# EAGLE design arwe (EAGLE 6.3)
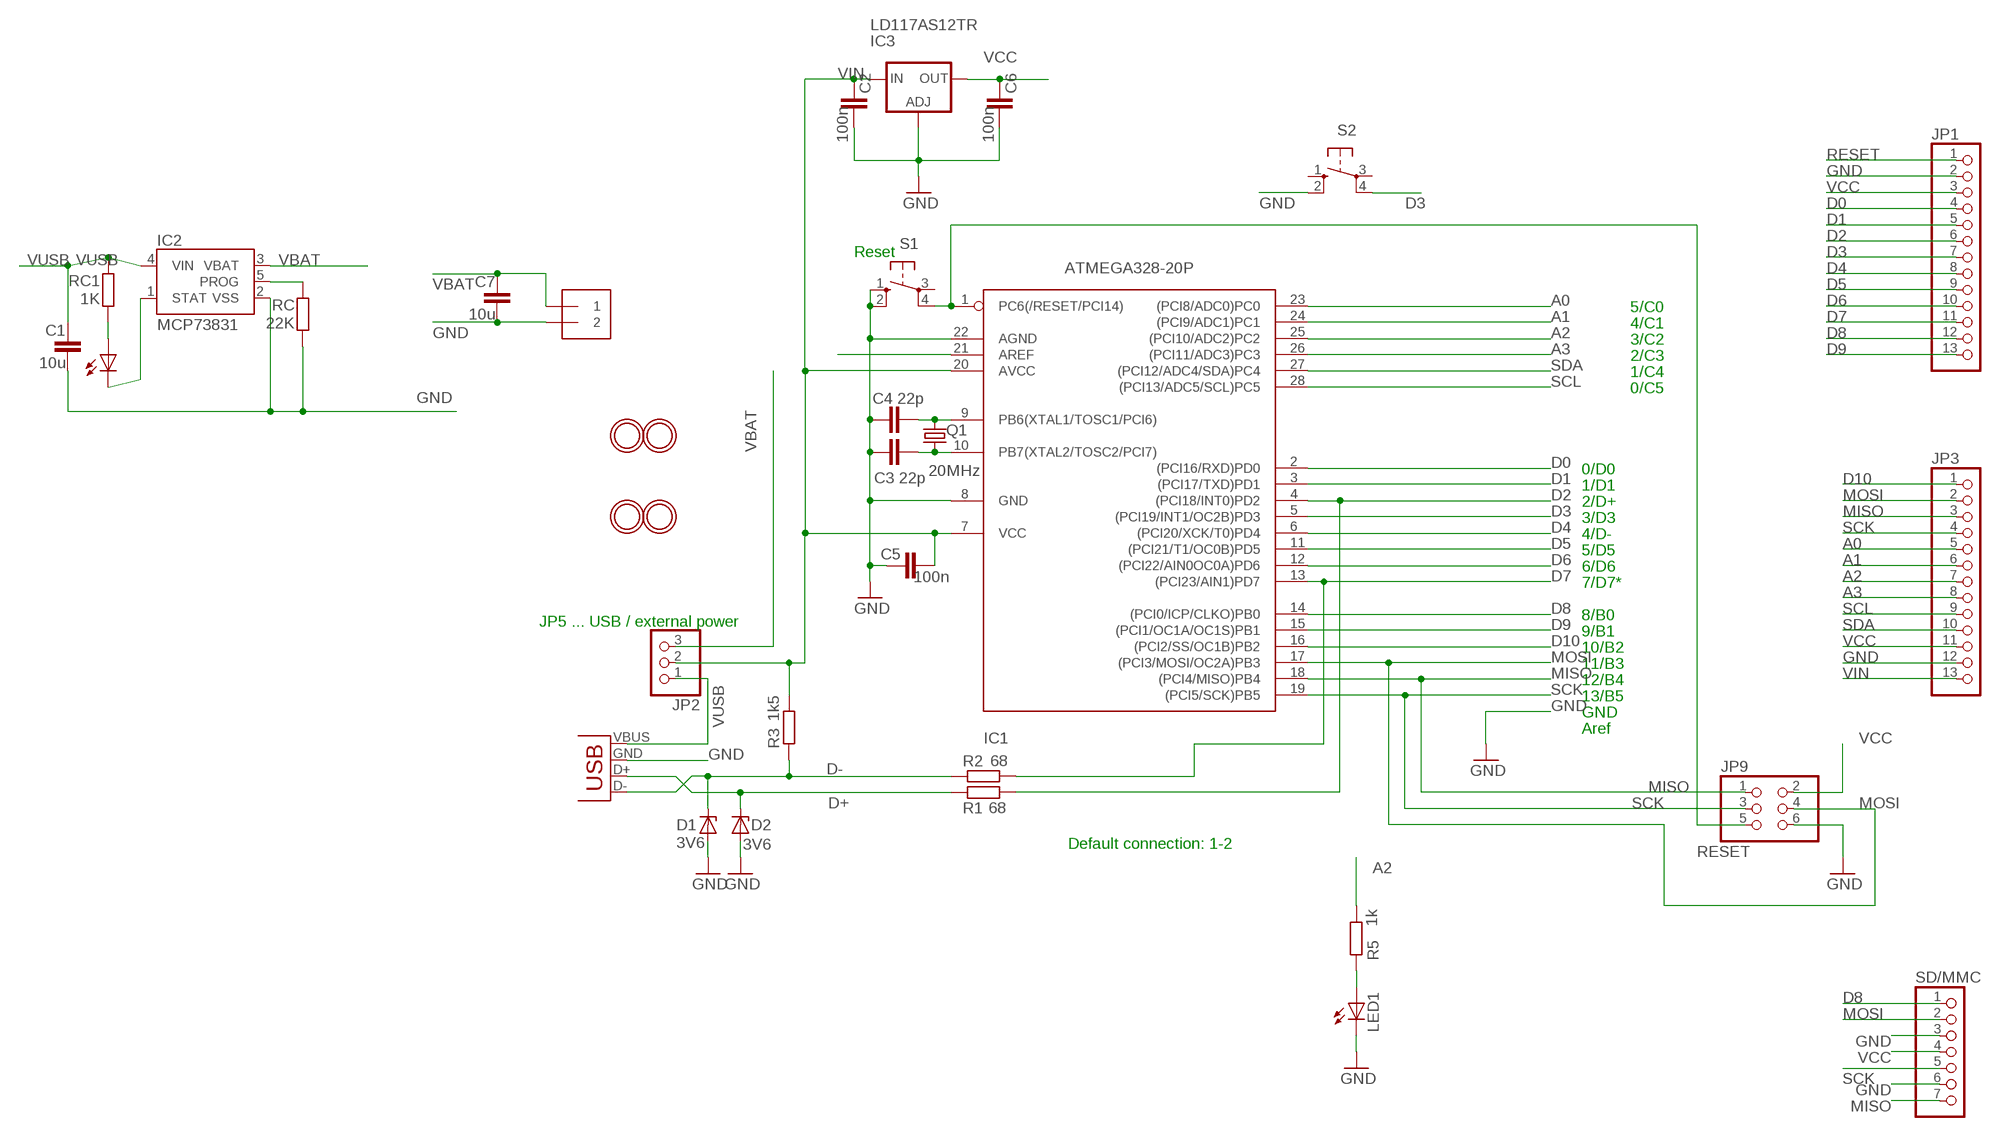
[diagram p0: schematic, sheet 1]

## Parts
C1  10u  C-EUC0603  [C0603]
C2  100n  C-EU025-024X044  [C025-024X044]
C3  22p  C-EU025-024X044  [C025-024X044]
C4  22p  C-EU025-024X044  [C025-024X044]
C5  100n  C-EU025-024X044  [C025-024X044]
C6  100n  C-EU025-024X044  [C025-024X044]
C7  10u  C-EUC0603  [C0603]
CHG  0805  LEDCHIPLED_0603  [CHIPLED_0603]
D1  3V6  ZENER-DIODEZD-5  [ZDIO-5]
D2  3V6  ZENER-DIODEZD-5  [ZDIO-5]
IC1  ATMEGA328-20P  ATMEGA168-20P  [DIL28-3]
IC2  MCP73831  [SOT23-5]
IC3  LD117AS12TR  [SOT223]
J1  1X2-3.5MM  [1X2-3.5MM]
JP1  PINHD-1X13  [1X13]
JP2  PINHD-1X3  [1X03]
JP3  PINHD-1X13  [1X13]
JP9  PINHD-2X3  [2X03]
LED1  LED3MM  [LED3MM]
Q1  20MHz  CRYSTALHC49S  [HC49/S]
R1  68  R-EU_0204/5  [0204/5]
R2  68  R-EU_0204/5  [0204/5]
R3  1k5  R-EU_0204/5  [0204/5]
R5  1k  R-EU_0204/5  [0204/5]
RC  22K  R-EU_R0603  [R0603]
RC1  1K  R-EU_R0603  [R0603]
S1  10-XX  [B3F-10XX]
S2  10-XX  [B3F-10XX]
SD/MMC  PINHD-1X7  [1X07]
U$2  MOUNTINGHOLE3.0THIN  [MOUNTINGHOLE_3.0_PLATEDTHIN]
U$3  MOUNTINGHOLE3.0THIN  [MOUNTINGHOLE_3.0_PLATEDTHIN]
U$4  MOUNTINGHOLE3.0THIN  [MOUNTINGHOLE_3.0_PLATEDTHIN]
U$5  MOUNTINGHOLE3.0THIN  [MOUNTINGHOLE_3.0_PLATEDTHIN]
X1  USB-A-H  [USB-A-H]

## Nets
A0: IC1.23((PCI8/ADC0)PC0) JP3.5
A1: IC1.24((PCI9/ADC1)PC1) JP3.6
A2: IC1.25((PCI10/ADC2)PC2) JP3.7 R5.1
A3: IC1.26((PCI11/ADC3)PC3) JP3.8
AREF_RAW: IC1.21(AREF)
D0: IC1.2((PCI16/RXD)PD0) JP1.4
D1: IC1.3((PCI17/TXD)PD1) JP1.5
D2: IC1.4((PCI18/INT0)PD2) JP1.6 R1.2
D3: IC1.5((PCI19/INT1/OC2B)PD3) JP1.7 S2.4(P1)
D4: IC1.6((PCI20/XCK/T0)PD4) JP1.8
D5: IC1.11((PCI21/T1/OC0B)PD5) JP1.9
D6: IC1.12((PCI22/AIN0OC0A)PD6) JP1.10
D7: IC1.13((PCI23/AIN1)PD7) JP1.11 R2.2
D8: IC1.14((PCI0/ICP/CLKO)PB0) JP1.12 SD/MMC.1
D9: IC1.15((PCI1/OC1A/OC1S)PB1) JP1.13
D10: IC1.16((PCI2/SS/OC1B)PB2) JP3.1
D+: D2.C R1.1 X1.D+(D-)
D-: D1.C R2.1 R3.1 X1.D-(D+)
GND: C1.2 C2.2 C3.1 C4.1 C5.1 C6.2 C7.2 D1.A D2.A IC1.8(GND) IC1.22(AGND) IC2.2(VSS) IC3.1(ADJ) J1.2 JP1.2 JP3.12 JP9.6 LED1.K(C) RC.1 S1.1(S) S1.2(S1) S2.2(S1) SD/MMC.3 SD/MMC.6 X1.GND(VBUS)
MISO: IC1.18((PCI4/MISO)PB4) JP3.3 JP9.1 SD/MMC.7
MOSI: IC1.17((PCI3/MOSI/OC2A)PB3) JP3.2 JP9.4 SD/MMC.2
N$1: LED1.A R5.2
N$4: CHG.A RC1.1
N$5: CHG.C IC2.1(STAT)
N$6: IC2.5(PROG) RC.2
N$9: C3.2 IC1.10(PB7(XTAL2/TOSC2/PCI7)) Q1.1
N$10: C4.2 IC1.9(PB6(XTAL1/TOSC1/PCI6)) Q1.2
RESET: IC1.1(PC6(/RESET/PCI14)) JP1.1 JP9.5 S1.4(P1)
SCK: IC1.19((PCI5/SCK)PB5) JP3.4 JP9.3 SD/MMC.5
SCL: IC1.28((PCI13/ADC5/SCL)PC5) JP3.9
SDA: IC1.27((PCI12/ADC4/SDA)PC4) JP3.10
VBAT: C7.1 IC2.3(VBAT) J1.1 JP2.3
VCC: C6.1 IC3.4(OUT) JP1.3 JP3.11 JP9.2 SD/MMC.4
VIN: C2.1 C5.2 IC1.7(VCC) IC1.20(AVCC) IC3.3(IN) JP2.2 JP3.13 R3.2
VUSB: C1.1 IC2.4(VIN) JP2.1 RC1.2 X1.VBUS(GND)
Unconnected: S1.3(P) S2.1(S) S2.3(P)

## Notes on the sheet
- Reset
- 5/C0
- 4/C1
- 3/C2
- 2/C3
- 1/C4
- 0/C5
- 0/D0
- 1/D1
- 2/D+
- 3/D3
- 4/D-
- 5/D5
- 6/D6
- 7/D7*
- 8/B0
- JP5 ... USB / external power
- 9/B1
- 10/B2
- 11/B3
- 12/B4
- 13/B5
- GND
- Aref
- Default connection: 1-2

## Library data of the parts
C1 C7 = resistor:C-EU: CAPACITOR, European symbol
C2-C6 = rcl:C-EU: CAPACITOR, European symbol
CHG LED1 = led:LED: LED OSRAM: - CHIPLED LG R971, LG N971, LY N971, LG Q971, LY Q971, LO R971, LY R971 LH N974, LH R974 LS Q976, LO Q976, LY Q976 LO Q996 - Hyper CHIPLED LW Q18S LB Q993, LB Q99A, LB R99A - SideLED LS A670, LO A670, LY A670, LG A670, LP A670 LB A673, LV A673, LT A673, LW A673 LH A674 LY A675 LS A676, LA A676, LO A676, LY A676, LW A676 LS A679, LY A679, LG A679 - Hyper Micro SIDELED® LS Y876, LA Y876, LO Y876, LY Y876 LT Y87S - SmartLED LW L88C, LW L88S LB L89C, LB L89S, LG L890 LS L89K, LO L89K, LY L89K LS L896, LA L896, LO L896, LY L896 - TOPLED LS T670, LO T670, LY T670, LG T670, LP T670 LSG T670, LSP T670, LSY T670, LOP T670, LYG T670 LG T671, LOG T671, LSG T671 LB T673, LV T673, LT T673, LW T673 LH T674 LS T676, LA T676, LO T676, LY T676, LB T676, LH T676, LSB T676, LW T676 LB T67C, LV T67C, LT T67C, LS T67K, LO T67K, LY T67K, LW E67C LS E67B, LA E67B, LO E67B, LY E67B, LB E67C, LV E67C, LT E67C LW T67C LS T679, LY T679, LG T679 LS T770, LO T770, LY T770, LG T770, LP T770 LB T773, LV T773, LT T773, LW T773 LH T774 LS E675, LA E675, LY E675, LS T675 LS T776, LA T776, LO T776, LY T776, LB T776 LHGB T686 LT T68C, LB T68C - Hyper Mini TOPLED® LB M676 - Mini TOPLED Santana® LG M470 LS M47K, LO M47K, LY M47K Source: http://www.osram.convergy.de LUXEON: - LUMILED® LXK2-PW12-R00, LXK2-PW12-S00, LXK2-PW14-U00, LXK2-PW14-V00 LXK2-PM12-R00, LXK2-PM12-S00, LXK2-PM14-U00 LXK2-PE12-Q00, LXK2-PE12-R00, LXK2-PE12-S00, LXK2-PE14-T00, LXK2-PE14-U00 LXK2-PB12-K00, LXK2-PB12-L00, LXK2-PB12-M00, LXK2-PB14-N00, LXK2-PB14-P00, LXK2-PB14-Q00 LXK2-PR12-L00, LXK2-PR12-M00, LXK2-PR14-Q00, LXK2-PR14-R00 LXK2-PD12-Q00, LXK2-PD12-R00, LXK2-PD12-S00 LXK2-PH12-R00, LXK2-PH12-S00 LXK2-PL12-P00, LXK2-PL12-Q00, LXK2-PL12-R00 Source: www.luxeon.com KINGBRIGHT: KA-3528ASYC Source: www.kingbright.com
D1 D2 = diode:ZENER-DIODE: Z-Diode
IC1 = avr:ATMEGA168*P: MICROCONTROLLER 16 kBytes FLASH 1 kBytes SRAM 512 Bytes EEPROM USART 8-channel 10 bit ADC
IC2 = SparkFunNew:MCP73831: Microchip's MCP73831 Miniature single cell, fully integrated Li-Ion, Li-polymer charge management controller http://ww1.microchip.com/downloads/en/DeviceDoc/21984a.pdf
IC3 = v-reg:LD117A?*: Low drop fixed and adjustable positive voltage regulators 1 A Source: http://www.st.com/stonline/products/literature/ds/7194/ld1117axx.pdf
J1 = adafruit:1X2: 3.5mm Terminal block http://www.ladyada.net/library/pcb/eaglelibrary.html
JP1 JP3 = pinhead:PINHD-1X13: PIN HEADER
JP2 = pinhead:PINHD-1X3: PIN HEADER
JP9 = pinhead:PINHD-2X3: PIN HEADER
Q1 = crystal:CRYSTAL: CRYSTAL; OC_FARNELL: 1667008; OC_NEWARK: unknown
R1-R3 R5 RC RC1 = rcl:R-EU_: RESISTOR, European symbol
S1 S2 = switch-omron:10-XX: OMRON SWITCH; MPN: B3F-1000; OC_FARNELL: 176432; OC_NEWARK: 36M3542
SD/MMC = pinhead:PINHD-1X7: PIN HEADER
U$2-U$5 = microbuilder:MOUNTINGHOLE: Mounting Hole
X1 = SparkFun:USB: USB Connectors USB-B-PTH is fully proven SKU : PRT-00139 USB-miniB is fully proven SKU : PRT-00587 USB-A-PCB is untested. USB-A-H is throughly reviewed, but untested. Spark Fun Electronics SKU : PRT-00437 USB-B-SMT is throughly reviewed, but untested. Needs silkscreen touching up. USB-A-S has not been used/tested USB-MB-H has not been used/tested

## Net classes
0 default: width 0.279 mm, drill 0.381 mm, clearance 0.305 mm
1 GND: width 0.229 mm, drill 0.381 mm, clearance 0.229 mm

## Board
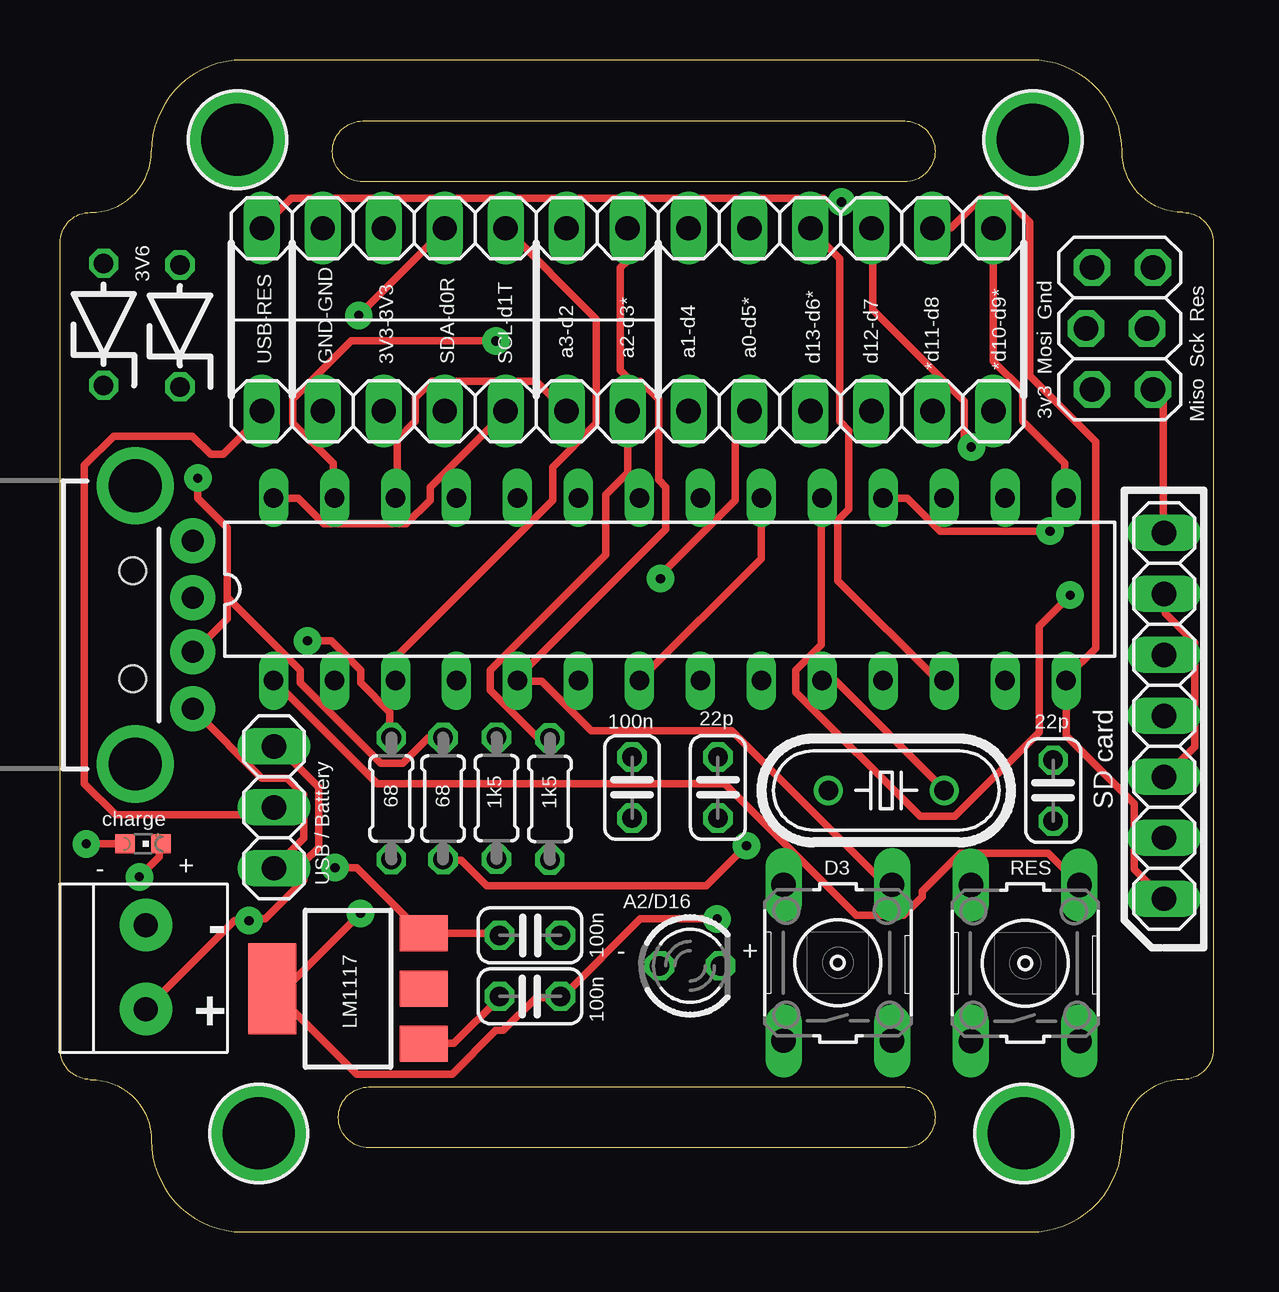
[diagram p1: board, top side]
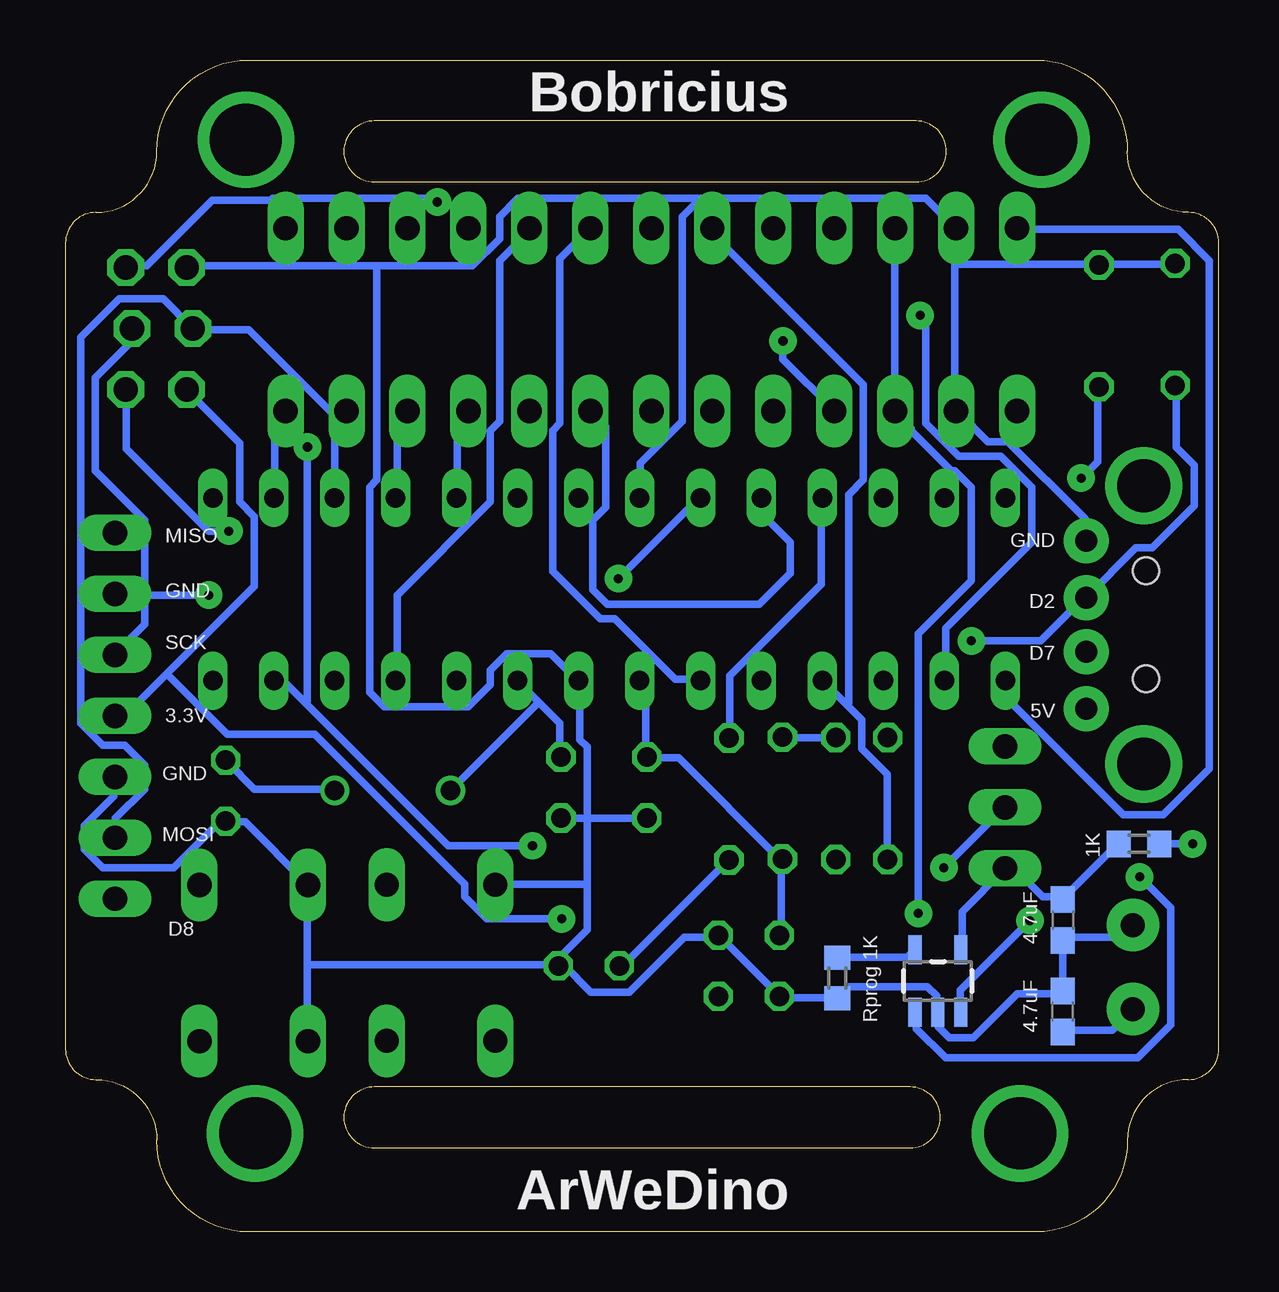
[diagram p2: board, bottom side, seen from below]

Size 48.06 x 48.83 mm. Coordinates in mm from the lower left corner, seen from the top.
Outline: 46.79,42.48 arc-90 48.06,41.21 48.06,7.62 arc-90 46.79,6.35 arc90 44.25,3.81 arc-90 40.44,0 7.62,0 arc-90 3.81,3.81 arc90 1.27,6.35 arc-90 0,7.62 0,41.21 arc-90 1.27,42.48 arc90 3.81,45.02 arc-90 7.62,48.83 40.44,48.83 arc-90 44.25,45.02 arc90 46.79,42.48
Outline: 35.19,46.29 arc-90 36.46,45.02 arc-90 35.19,43.75 12.62,43.75 arc-90 11.35,45.02 arc-90 12.62,46.29 35.19,46.29
Outline: 35.19,6.04 arc-90 36.46,4.77 arc-90 35.19,3.5 12.87,3.5 arc-90 11.6,4.77 arc-90 12.87,6.04 35.19,6.04
Copper layers (1*16): Top 0.035mm / dielectric 1.5mm / Bottom 0.035mm
Design rules "mine *": minimum track width 12mil, minimum drill 12mil, track to track 8mil, track to pad 8mil, pad to pad 8mil, via to via 8mil, smd to smd 8mil, copper to edge 8mil, drill to drill 20mil, minimum pad ring 8mil, minimum via ring 15mil, stop-mask expansion 4mil, vias tented up to drill 20mil, thermal gap 10mil
tRestrict: area 2.9,44.4 to 48.9,51.1; area -1.5,-3.3 to 54.8,5.8
bRestrict: area -2.6,-3.5 to 53.6,5.8; area 1.4,44.2 to 49.9,52

### Footprints (pad centres in the part's own frame; a part is rotated, then mirrored left to right if it is on the bottom)
C0603 = smd 1.1 x 1: 1 -0.85,0; 2 0.85,0
C025-024X044 = drill 0.813 octagon: 1 -1.27,0; 2 1.27,0
CHIPLED_0603 = smd 0.8 x 0.8: A 0,-0.75; C 0,0.75
ZDIO-5 = drill 0.813 octagon: A 2.54,0; C -2.54,0
DIL28-3 = drill 0.813 long: 1 -16.51,-3.81; 2 -13.97,-3.81; 3 -11.43,-3.81; 4 -8.89,-3.81; 5 -6.35,-3.81; 6 -3.81,-3.81; 7 -1.27,-3.81; 8 1.27,-3.81; 9 3.81,-3.81; 10 6.35,-3.81; 11 8.89,-3.81; 12 11.43,-3.81; 13 13.97,-3.81; 14 16.51,-3.81; 15 16.51,3.81; 16 13.97,3.81; 17 11.43,3.81; 18 8.89,3.81; 19 6.35,3.81; 20 3.81,3.81; 21 1.27,3.81; 22 -1.27,3.81; 23 -3.81,3.81; 24 -6.35,3.81; 25 -8.89,3.81; 26 -11.43,3.81; 27 -13.97,3.81; 28 -16.51,3.81
SOT23-5 = smd 0.55 x 1.2: 1 -0.95,-1.3; 2 0,-1.3; 3 0.95,-1.3; 4 0.95,1.3; 5 -0.95,1.3
SOT223 = smd 1.5 x 2: 1 -2.3,-3.15; 2 0,-3.15; 3 2.3,-3.15 | smd 3.8 x 2: 4 0,3.15
1X2-3.5MM = drill 1 pad 2.184: 1 1.8,0; 2 -1.7,0
1X13 = drill 1.016 long: 1 -15.24,0; 2 -12.7,0; 3 -10.16,0; 4 -7.62,0; 5 -5.08,0; 6 -2.54,0; 7 0,0; 8 2.54,0; 9 5.08,0; 10 7.62,0; 11 10.16,0; 12 12.7,0; 13 15.24,0
1X03 = drill 1.016 long: 1 -2.54,0; 2 0,0; 3 2.54,0
2X03 = drill 1.016 octagon: 1 -2.54,-1.397; 2 -2.54,1.143; 3 0,-1.143; 4 0,1.397; 5 2.54,-1.397; 6 2.54,1.143
LED3MM = drill 0.813 octagon: A -1.27,0; K 1.27,0
HC49/S = drill 0.813: 1 -2.413,0; 2 2.413,0
0204/5 = drill 0.813 octagon: 1 -2.54,0; 2 2.54,0
R0603 = smd 1 x 1.1: 1 -0.85,0; 2 0.85,0
B3F-10XX = drill 1.016 long: 1 -3.251,2.261; 2 3.251,2.261; 3 -3.251,-2.261; 4 3.251,-2.261
1X07 = drill 1.016 long: 1 -7.62,0; 2 -5.08,0; 3 -2.54,0; 4 0,0; 5 2.54,0; 6 5.08,0; 7 7.62,0
MOUNTINGHOLE_3.0_PLATEDTHIN = drill 3 pad 3.6: P$1 0,0
USB-A-H = drill 0.914 pad 1.88: D+ 2.4,1.127; D- 2.4,-1.127; GND 2.4,3.5; VBUS 2.4,-3.5 | drill 2.2: GND2 0,-5.8; GND3 0,5.8 | hole 1.1: -0.1,2.25; -0.1,-2.25

### Placement (x,y rotation side)
C1  6.5,12.99 270 bottom
C2  19.59,12.36 0 top
C3  41.38,18.39 90 top
C4  27.41,18.51 90 top
C5  23.84,18.51 90 top
C6  19.59,9.82 180 top
C7  6.5,9.18 90 bottom
CHG  3.46,16.17 270 top
D1  5,37.75 90 top
D2  1.82,37.82 90 top
IC1  25.41,26.78 0 top
IC2  11.71,10.45 0 bottom
IC3  12,10.14 90 top
J1  3.58,11.09 270 top
JP1  23.65,41.82 0 top
JP2  8.92,17.69 90 top
JP3  23.65,34.2 180 top
JP9  44.15,37.64 90 top
LED1  26.25,11.09 0 top
Q1  34.43,18.39 180 top
R1  13.8,18.06 270 top
R2  15.96,18.06 270 top
R3  18.19,18.07 270 top
R5  20.41,18.04 270 top
RC  15.9,10.58 90 bottom
RC1  3.33,16.17 180 bottom
S1  40.22,11.2 90 top
S2  32.41,11.22 90 top
SD/MMC  46,21.5 90 top
U$2  40.16,4.1 0 top
U$3  8.28,4.1 0 top
U$4  7.39,45.5 0 top
U$5  40.54,45.5 0 top
X1  3.13,25.29 0 top

### Tracks (layer width: path | path; a pad name or v marks a point on that pad's centre or on a via)
A0  (via drill 0.38)
  Top 0.305: v25.02,27.22 25.02,27.37 28.14,30.49 28.14,33.62 JP3.5
  Bottom 0.305: v25.02,27.22 21.67,30.57 IC1.23
A1
  Bottom 0.305: IC1.24 19,30.57 19,29.88 17.86,28.74 17.86,27.45 19.15,26.15 25.48,26.15 26.09,26.76 26.09,29.66 25.55,30.19 25.55,33.54 26.16,34.15 JP3.6
A2
  Top 0.305: JP3.7 23.65,31.64 22.73,30.72 22.73,28.21 17.93,23.41 17.93,22.57 19.91,20.59 20.37,20.59 R5.1
  Bottom 0.305: IC1.25 16.56,30.57 16.56,26.99 20.37,23.18 20.37,20.59 R5.1
A3
  Top 0.305: IC1.26 14.05,30.65 14.05,33.01 14.81,33.77 14.81,34.76 15.5,35.45 19.84,35.45 21.06,34.23 JP3.8
D0  (via drill 0.38)
  Top 0.305: v12.45,38.19 16.03,41.77 JP1.4
  Bottom 0.305: v12.45,38.19 12.22,37.96 12.22,33.69 10.85,32.32 9.09,32.32 7.8,31.03 7.8,28.74 11.38,25.16 11.38,23.03 IC1.2
D1
  Top 0.305: JP1.5 22.35,38.04 22.35,33.69 20.53,31.87 20.53,30.49 14.05,24.02 14.05,23.03 IC1.3
D2
  Bottom 0.305: 15.5,21.96 16.49,22.95 IC1.4 | 15.5,21.96 14.89,21.35 14.89,20.13 13.82,19.06 13.82,15.56 R1.2 | JP1.6 21.06,41.77 21.06,41.54 14.81,35.29 14.81,31.33 15.42,30.72 15.42,22.04 15.5,21.96
D3
  Top 0.305: S2.4 34.62,14.49 34.39,14.49 27.99,20.89 22.12,20.89 20.07,22.95 19.08,22.95 IC1.5 19.08,23.1 25.25,29.27 25.25,31.03 24.94,31.33 24.94,34.68 24.18,35.45 23.8,35.45 23.34,35.9 23.34,40.17 23.65,40.48 JP1.7
D4
  Bottom 0.305: JP1.8 27.46,40.55 27.46,33.69 27.76,33.39 27.76,27.52 25.78,25.54 25.17,25.54 22.66,23.03 21.67,23.03 IC1.6
D5
  Bottom 0.305: IC1.11 34.24,23.03 34.24,26.53 30.36,30.42 30.36,33.39 29.97,33.77 29.97,40.48 28.68,41.77 JP1.9
D6
  Top 0.305: IC1.12 36.83,23.03 36.53,23.03 32.41,27.14 32.41,29.66 32.87,30.11 32.87,33.39 32.49,33.77 32.49,40.55 31.27,41.77 JP1.10
D7  (via drill 0.38)
  Top 0.305: v28.6,16.09 26.93,14.42 17.78,14.42 16.71,15.48 16.03,15.48 R2.2 | v37.97,32.7 37.67,33.01 37.67,34.61 33.86,38.42 33.86,41.77 JP1.11
  Bottom 0.305: v28.6,16.09 32.11,16.09 38.05,22.04 | 38.05,22.04 38.96,22.95 39.35,22.95 IC1.13 | v37.97,32.7 37.97,22.11 38.05,22.04
D8
  Top 0.305: SD/MMC.1 45.98,13.88 44.76,15.1 44.76,17.84 41.94,20.66 41.94,22.95 IC1.14 41.94,23.1 43.16,24.32 43.16,32.93 40.41,35.67 40.41,42.08 39.42,43.07 38.36,43.07 37.14,41.85 36.37,41.85 JP1.12
D9
  Top 0.305: JP1.13 38.89,36.28 40.11,35.07 40.11,33.77 41.86,32.02 41.86,30.65 IC1.15
D10
  Bottom 0.305: IC1.16 39.35,30.65 39.35,33.69 38.89,34.15 JP3.1
D+  (via drill 0.38)
  Top 0.305: v10.31,24.63 11.3,24.63 12.52,23.41 12.52,22.87 13.74,21.65 13.74,20.66 R1.1
  Bottom 0.305: D2.C 1.78,35.22 1.78,32.7 1.02,31.94 1.02,30.27 2.77,28.51 3.46,28.51 5.51,26.45 X1.D+ 5.67,26.38 7.42,24.63 v10.31,24.63
D-  (via drill 0.38)
  Top 0.305: v5.74,31.41 5.74,30.57 6.96,29.35 6.96,26.38 | 6.96,26.38 6.96,25.54 5.59,24.17 X1.D- | R2.1 15.34,20.59 14.28,19.52 13.36,19.52 10.01,22.87 10.01,23.41 7.04,26.38 6.96,26.38
  Bottom 0.305: R2.1 16.03,20.59 18.16,20.59 R3.1 | v5.74,31.41 5.06,32.09 5.06,35.14 D1.C
GND
  Top 0.305: IC3.1 15.19,7.86 16.41,7.86 18.32,9.77 C6.2 | SD/MMC.6 46.05,26.53 46.05,25.77 47.27,24.55 47.27,20.21 46.05,18.99 SD/MMC.3
  Bottom 0.305: D2.A 1.86,40.32 4.98,40.32 D1.A 5.13,40.32 11,40.32 | 21.67,42.99 21.59,43.07 12.22,43.07 11,41.85 JP1.2 11,41.7 11,40.32 | 21.67,42.99 22.35,42.3 22.35,33.77 24.11,32.02 24.11,30.65 IC1.22 | 11,40.32 11,34.23 JP3.12 10.85,34.15 9.63,32.93 8.79,32.93 5.59,29.73 5.59,28.82 X1.GND | 35.08,40.25 31.12,40.25 29.97,41.39 29.97,42.3 29.21,43.07 21.74,43.07 21.67,42.99 | 35.08,40.25 43,40.25 JP9.6 | J1.2 3.61,12.74 4.07,12.28 6.43,12.28 C1.2 C7.2 6.58,9.92 8.41,9.92 10.24,8.09 11.23,8.09 11.69,8.55 11.69,9.01 IC2.2 11.76,9.16 11.76,9.84 12.14,10.22 15.42,10.22 15.8,9.84 RC.1 15.95,9.77 18.32,9.77 C6.2 18.39,9.92 20.83,12.36 C2.2 20.98,12.28 22.28,12.28 24.56,10 26.16,10 27.31,11.14 LED1.K | 26.32,17.23 27.38,17.23 C4.1 | 26.32,17.23 23.88,17.23 C5.1 | 26.32,17.23 26.32,14.49 | 26.32,14.49 26.32,12.59 27.46,11.44 27.46,11.14 LED1.K | 26.32,17.23 26.32,20.21 26.62,20.51 26.62,22.95 IC1.8 26.77,23.03 27.84,24.09 29.67,24.09 30.36,23.41 30.36,22.8 31.27,21.88 34.77,21.88 35.38,22.49 35.38,31.03 35.08,31.33 35.08,40.25 | 26.32,14.49 30.13,14.49 S2.2 | 37.97,11.14 37.97,14.34 S1.2 37.97,14.49 40.56,17.08 41.33,17.08 C3.1 41.48,17.23 43.54,15.18 46.51,15.18 47.27,15.94 47.27,16.93 46.05,18.15 46.05,18.91 SD/MMC.3 | 37.97,11.14 37.97,8.01 S1.1 | 37.97,11.14 27.61,11.14 LED1.K
MISO  (via drill 0.38)
  Top 0.305: SD/MMC.7 45.98,29.12 45.98,34.68 45.59,35.07 JP9.1 | v41.25,29.2 36.68,29.2 35.31,30.57 34.32,30.57 IC1.18
  Bottom 0.305: JP3.3 34.24,33.77 34.24,30.65 IC1.18 | v41.25,29.2 42.09,29.2 45.52,32.63 45.52,35.07 JP9.1
MOSI
  Bottom 0.305: IC1.17 36.83,30.65 36.83,33.69 36.37,34.15 JP3.2 36.75,33.92 40.41,37.58 42.62,37.58 JP9.4 42.77,37.66 43.99,38.88 45.82,38.88 47.42,37.27 47.42,21.2 46.51,20.28 45.59,20.28 44.76,19.45 44.76,18.45 45.98,17.23 45.98,16.47 SD/MMC.2
N$1
  Bottom 0.305: LED1.A 24.94,11.14 24.79,11.14 20.45,15.48 R5.2
N$4  (via drill 0.38)
  Top 0.305: v1.09,16.17 CHG.A
  Bottom 0.305: RC1.1 v1.09,16.17
N$5  (via drill 0.38)
  Top 0.305: v3.3,14.8 4.14,15.63 4.14,16.17 CHG.C
  Bottom 0.305: v3.3,14.8 2.01,13.5 2.01,8.62 3.38,7.25 11.38,7.25 12.6,8.47 12.6,9.08 IC2.1
N$6
  Bottom 0.305: RC.2 15.88,11.44 12.98,11.44 12.68,11.75 IC2.5
N$9
  Top 0.305: IC1.10 31.8,22.95 32.34,22.95 36.83,18.45 Q1.1
  Bottom 0.305: Q1.1 36.91,18.45 40.18,18.45 41.33,19.6 C3.2
N$10
  Bottom 0.305: 28.33,22.07 29.21,22.95 IC1.9 | 28.33,22.07 27.46,21.2 27.46,19.83 C4.2 | 28.33,22.07 31.96,18.45 Q1.2
RESET  (via drill 0.38)
  Top 0.305: S1.4 42.47,14.49 41.17,15.79 37.52,15.79 35.92,14.19 35.92,13.96 35.15,13.2 33.17,13.2 27.69,18.68 13.21,18.68 8.94,22.95 IC1.1 | v32.56,42.91 31.96,42.91 31.8,43.07 9.63,43.07 8.41,41.85 JP1.1
  Bottom 0.305: IC1.1 8.87,22.95 8.87,22.26 3.99,17.39 2.31,17.39 0.41,19.29 0.41,40.48 1.7,41.77 8.41,41.77 JP1.1 | v32.56,42.91 32.72,43.07 39.42,43.07 39.5,42.99 41.94,42.99 44.68,40.25 45.52,40.25 JP9.5
SCK  (via drill 0.38)
  Top 0.305: v42.09,26.53 40.79,25.24 40.79,20.82 37.29,17.31 35.84,17.31 30.66,22.49 30.66,23.41 31.73,24.47 31.73,30.57 IC1.19
  Bottom 0.305: IC1.19 31.73,30.65 31.73,33.69 31.27,34.15 JP3.4 | 44.76,26.53 44.76,25.31 45.98,24.09 SD/MMC.5 | 44.76,26.53 44.76,29.66 46.81,31.71 46.81,35.6 45.37,37.05 45.37,37.58 JP9.3 | 44.76,26.53 v42.09,26.53
SCL
  Top 0.305: IC1.28 8.94,30.57 9.93,30.57 11,29.5 14.43,29.5 15.42,30.49 15.42,31.03 18.54,34.15 JP3.9
SDA  (via drill 0.38)
  Top 0.305: v18.16,37.12 12.14,37.12 9.7,34.68 9.7,33.69 11.38,32.02 11.38,30.65 IC1.27
  Bottom 0.305: v18.16,37.12 18.16,36.36 16.03,34.23 JP3.10
VBAT  (via drill 0.38)
  Top 0.305: J1.1 3.61,9.31 7.27,12.97 v7.88,12.97 7.95,13.04 8.56,13.04 10.16,14.64 10.16,15.41 10.77,16.02 10.77,18.53 9.09,20.21 8.94,20.21 JP2.3
  Bottom 0.305: 10.77,9.16 IC2.3 10.77,9.31 10.77,10.07 v7.88,12.97 | C7.1 6.5,8.4 4.45,8.4 3.61,9.23 J1.1
VCC  (via drill 0.38)
  Top 0.305: v12.52,13.27 9.17,9.92 IC3.4 8.87,10.07 12.37,6.57 16.33,6.57 18.16,8.4 18.47,8.4 19.84,9.77 20.83,9.77 C6.1 20.98,9.84 24.18,13.04 v27.38,13.04
  Bottom 0.305: SD/MMC.4 45.59,21.5 43.84,23.25 | 43.84,23.25 40.18,26.91 40.18,29.81 40.79,30.42 40.79,32.86 43,35.07 JP9.2 | JP1.3 13.51,41.77 13.51,34.23 JP3.11 13.44,34.07 12.83,33.46 12.83,33.39 11.15,31.71 11,31.71 10.31,31.03 10.31,27.14 12.52,24.93 v12.52,13.27 | 43.84,23.25 41.33,20.74 37.67,20.74 31.42,14.49 31.42,13.96 30.51,13.04 v27.38,13.04
VIN  (via drill 0.38)
  Top 0.305: IC1.20 29.21,30.57 29.21,28.05 24.18,23.03 IC1.7 | C2.1 18.24,12.43 15.19,12.43 IC3.3 15.04,12.51 12.37,15.18 v11.46,15.18 | JP3.13 8.41,34 6.81,32.4 6.27,32.4 5.51,33.16 2.24,33.16 1.02,31.94 1.02,18.68 2.31,17.39 8.56,17.39 8.87,17.69 JP2.2
  Bottom 0.305: IC1.7 24.11,22.95 23.88,22.72 23.88,19.83 C5.2 23.73,19.75 22.51,19.75 18.32,15.56 R3.2 18.24,15.48 18.24,12.43 C2.1 | v11.46,15.18 8.94,17.69 JP2.2
VUSB
  Top 0.305: JP2.1 10.16,16.4 10.16,18.23 9.48,18.91 8.41,18.91 5.59,21.73 X1.VBUS
  Bottom 0.305: RC1.2 4.22,16.17 6.5,13.88 C1.1 6.58,13.96 7.34,13.96 8.48,15.1 8.79,15.1 JP2.1 8.94,15.1 10.7,13.35 10.7,11.83 IC2.4

### Text on the board
tNames: 3V6 | USB-RES | GND-GND | 3V3-3V3 | SDA-d0R | SCL-d1T | a3-d2 | a2-d3* | a1-d4 | a0-d5* | d13-d6* | d12-d7 | *d11-d8 | *d10-d9* | 3v3 Mosi Gnd | Miso Sck Res | 100n | 22p | 22p | 68 | 68 | 1k5 | 1k5 | SD card | charge | - | + | D3 | RES | - | USB / Battery | A2/D16 | 100n | - | + | + | 100n | LM1117
bNames: Bobricius | GND | MISO | D2 | GND | D7 | SCK | 5V | 3.3V | GND | 1K | MOSI | 4.7uF | D8 | 4.7uF | Rprog 1K | ArWeDino